# Altium schematic sheet Mcu.SchDoc
size A3; SheetNumber: 2; SheetTotal: 3
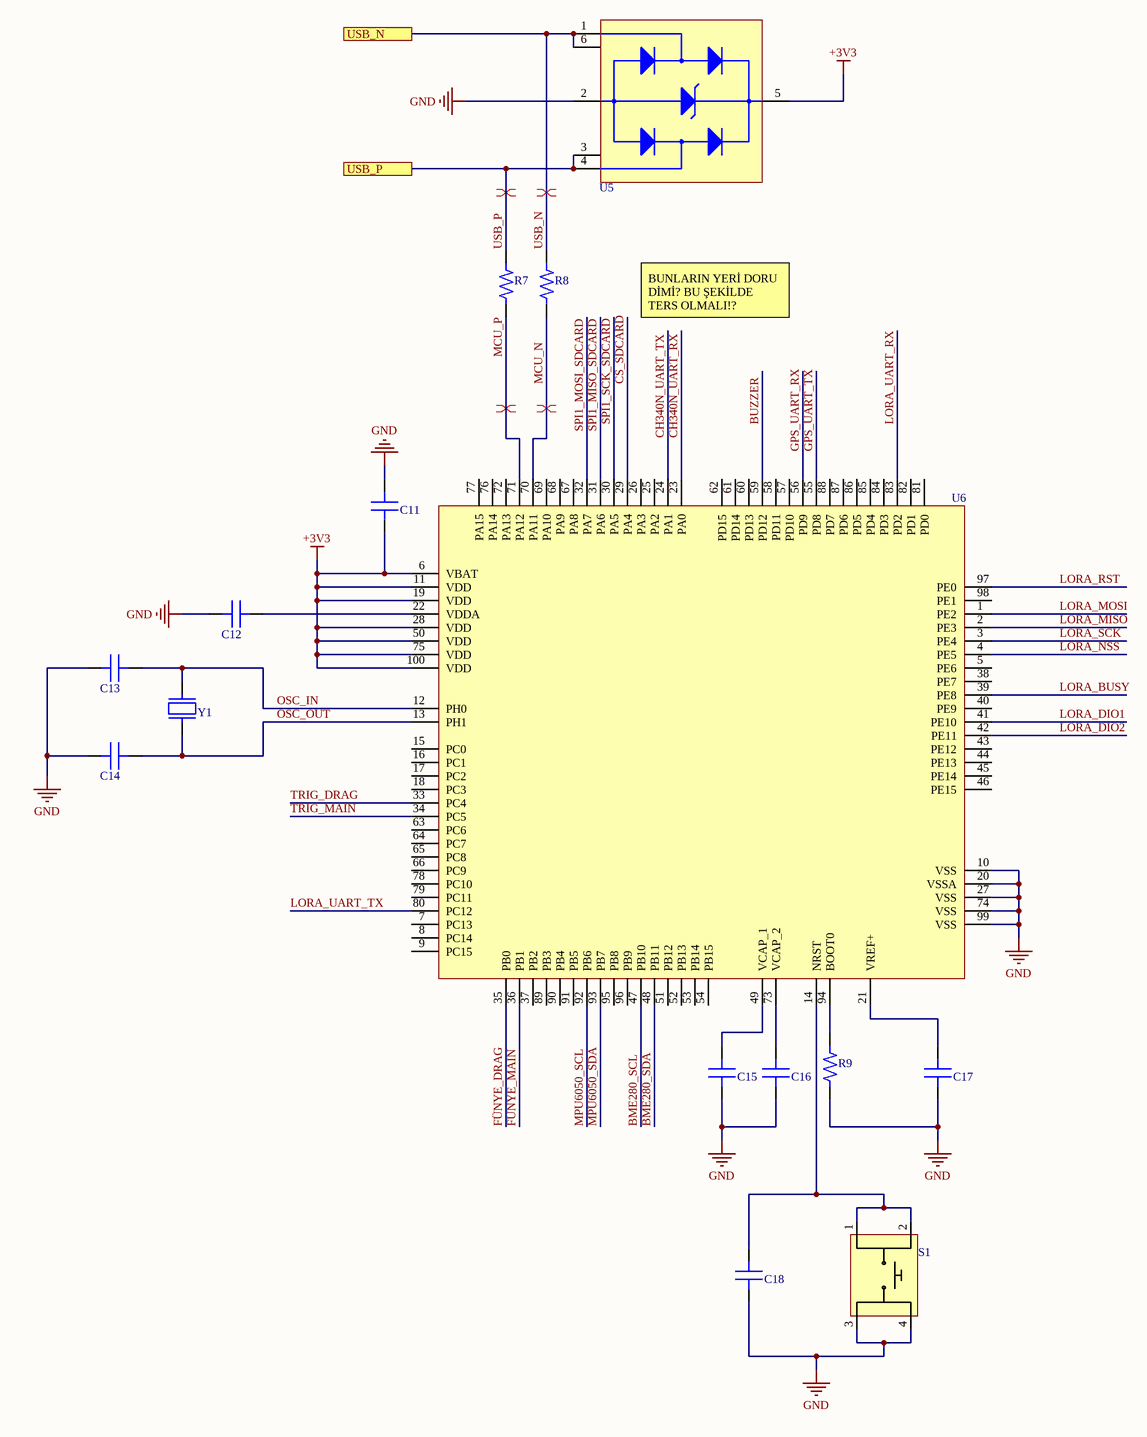
[diagram p0: Mcu.SchDoc]

## Parts
C11  CAP CER 1uF 0805  [CAP_0805]  (value not drawn)
C12  CAP CER 10nF 0805  [CAP_0805]  (value not drawn)
C13  CAP CER 20pF 0805  [CAP_0805]  (value not drawn)
C14  CAP CER 20pF 0805  [CAP_0805]  (value not drawn)
C15  CAP CER 2.2uF 0805  [CAP_0805]  (value not drawn)
C16  CAP CER 2.2uF 0805  [CAP_0805]  (value not drawn)
C17  CAP CER 10nF 0805  [CAP_0805]  (value not drawn)
C18  CAP CER 0.1uF 0805  [CAP_0805]  (value not drawn)
R7  RES 15 OHM 0805  [RES_0805]  (value not drawn)
R8  RES 15 OHM 0805  [RES_0805]  (value not drawn)
R9  RES 10K OHM 0805  [RES_0805]  (value not drawn)
S1  PTS815 SJG 250 SMTR LFS  [BUTTON]  (value not drawn)
U5  USBLC6-2SC6  [SOT-23-6L]  (value not drawn)
U6  STM32F407VGT6  [LQFP-100]  (value not drawn)
Y1  CRYSTAL 32.7680KHZ 12.5PF SMD  [CRYSTAL_ABS05]  (value not drawn)

## Ports
USB_N, USB_P

## Nets
+3V3: C11.1 U5.5(VBUS) U6.6(VBAT) U6.11(VDD) U6.19(VDD) U6.28(VDD) U6.50(VDD) U6.75(VDD) U6.100(VDD)
GND: C11.2 C12.1 C13.1 C14.1 C15.1 C16.1 C17.1 C18.1 R9.1 S1.3 S1.4 U5.2(GND) U6.10(VSS) U6.20(VSSA) U6.27(VSS) U6.74(VSS) U6.99(VSS)
BME280_SCL: U6.47(PB10)
BME280_SDA: U6.48(PB11)
BUZZER: U6.59(PD12)
CH340N_UART_RX: U6.23(PA0)
CH340N_UART_TX: U6.24(PA1)
CS_SDCARD: U6.29(PA4)
FÜNYE_DRAG: U6.35(PB0)
FÜNYE_MAIN: U6.36(PB1)
GPS_UART_RX: U6.56(PD9)
GPS_UART_TX: U6.55(PD8)
LORA_BUSY: U6.39(PE8)
LORA_DIO1: U6.41(PE10)
LORA_DIO2: U6.42(PE11)
LORA_MISO: U6.2(PE3)
LORA_MOSI: U6.1(PE2)
LORA_NSS: U6.4(PE5)
LORA_RST: U6.97(PE0)
LORA_SCK: U6.3(PE4)
LORA_UART_RX: U6.83(PD2)
LORA_UART_TX: U6.80(PC12)
MCU_N: R8.1 U6.70(PA11)
MCU_P: R7.1 U6.71(PA12)
MPU6050_SCL: U6.92(PB6)
MPU6050_SDA: U6.93(PB7)
OSC_IN: C13.2 U6.12(PH0) Y1.2
OSC_OUT: C14.2 U6.13(PH1) Y1.1
SPI1_MISO_SDCARD: U6.31(PA6)
SPI1_MOSI_SDCARD: U6.32(PA7)
SPI1_SCK_SDCARD: U6.30(PA5)
TRIG_DRAG: U6.33(PC4)
TRIG_MAIN: U6.34(PC5)
USB_N: R8.2 U5.1(I/O1_IN) U5.6(I/O1_OUT) ; port USB_N
USB_P: R7.2 U5.3(I/O2_IN) U5.4(I/O2_OUT) ; port USB_P
NetC12_2: C12.2 U6.22(VDDA)
NetC15_2: C15.2 U6.49(VCAP_1)
NetC16_2: C16.2 U6.73(VCAP_2)
NetC17_2: C17.2 U6.21(VREF+)
NetC18_2: C18.2 S1.1 S1.2 U6.14(NRST)
NetR9_2: R9.2 U6.94(BOOT0)

Not connected (* = marked no-connect by the designer): U6 5(PE6) 7(PC13) 8(PC14) 9(PC15) 15(PC0) 16(PC1) 17(PC2) 18(PC3) 25(PA2) 26(PA3) 37(PB2) 38(PE7) 40(PE9) 43(PE12) 44(PE13) 45(PE14) 46(PE15) 51(PB12) 52(PB13) 53(PB14) 54(PB15) 57(PD10) 58(PD11) 60(PD13) 61(PD14) 62(PD15) 63(PC6) 64(PC7) 65(PC8) 66(PC9) 67(PA8) 68(PA9) 69(PA10) 72(PA13) 76(PA14) 77(PA15) 78(PC10) 79(PC11) 81(PD0) 82(PD1) 84(PD3) 85(PD4) 86(PD5) 87(PD6) 88(PD7) 89(PB3) 90(PB4) 91(PB5) 95(PB8) 96(PB9) 98(PE1)

## Layout directives
differential pair: MCU_N, MCU_P, USB_N, USB_P

## Notes on the sheet
- BUNLARIN YERİ DORU DİMİ? BU ŞEKİLDE TERS OLMALI!?
- - The high-speed external (HSE) clock can be supplied with a 4 to 26 MHz crystal/ceramic
  resonator oscillator.
  - For CL1 and CL2, it is recommended to use high-quality external ceramic capacitors in the
  5 pF to 25 pF range. CL1 and CL2 are usually the
  same size. (Ben 20pF seçtim)
- (near C17) BOOT0 ekleme yapılabilir-amerika roket

## Library data of the parts
S1 = BUTTON: Switch Tactile N.O. SPST Button J-Bend 0.05A 12VDC 3.92N SMD T/R; Manufacturer: ITT C&K; Supplier 1: Digi-Key; Manufacturer Part Number: PTS815SJG250SMTRLFS; RoHS: Yes; Category: Tactile Switches; Stock 1: 47215; Pricing 1: 1=0,22000, 10=0,21400, 25=0,20280, 100=0,18360, 250=0,16736, 500=0,15558, 1000=0,13271 (USD); Supplier Part Number 1: CKN12217-1-ND
U5 = USB PROTECTION: TVS DIODE 5.25VWM 17VC SOT23-6; Manufacturer: STMicroelectronics; Direction: Unidirectional,Bidirectional; Capacitance: 3.5pF; Operating Supply Voltage: 1.1V; Number of Channels: 2; Breakdown Voltage: 6V; Clamping Voltage: 17V; Reverse Standoff Voltage: 5.25V; Power Line Protection: Yes; Test Current: 1mA; Max Reverse Leakage Current: 150nA; Peak Pulse Current: 5A; Element Configuration: Dual; Data Rate: 480Mbps; Number of Elements: 1; Working Voltage: 5V; Supplier 1: Digi-Key; Manufacturer Part Number: USBLC6-2SC6; RoHS: Yes; Category: TVS Diodes; Stock 1: 127716; Pricing 1: 1=0,61000, 10=0,52200, 100=0,38970, 500=0,30620, 1000=0,23660 (USD); Mount: Surface Mount; Case/Package: SOT-23; Number of Pins: 6; Contact Plating: Tin,Matte; Min Operating Temperature: -40°C; Max Operating Temperature: 125°C; Packaging: Tape and Reel; Package Quantity: 3000; Termination: SMD/SMT; Number of Bidirectional Channels: 2; Min Breakdown Voltage: 6V; ESD Protection: Yes; Leakage Current: 150nA; Series: USB; Reverse Breakdown Voltage: 6V; Polarity: Unidirectional,Bidirectional; Max Breakdown Voltage: 6V; Clamping Voltage-Max: 17V; Length: 3.05mm; Width: 1.75mm; Height: 1.3mm; Depth: 1.75mm; Radiation Hardening: No; Reach SVHC Compliant: Yes; Lead Free: Lead Free; RoHS Compliant: Yes; ComponentLink1URL: https://datasheet.ciiva.com/1268/1690354-1268384.pdf?src-supplier=Element14; ComponentLink1Description: https://datasheet.ciiva.com/1268/1690354-1268384.pdf?src-supplier=Element14; ComponentLink2URL: https://datasheet.ciiva.com/4508/cd00050750-113117-4508433.pdf?src-supplier=Mouser; ComponentLink2Description: https://datasheet.ciiva.com/4508/cd00050750-113117-4508433.pdf?src-supplier=Mouser; ComponentLink3URL: https://datasheet.ciiva.com/15143/getdatasheetpartid-148465-15143789.pdf?src-supplier=Verical; ComponentLink3Description: https://datasheet.ciiva.com/15143/getdatasheetpartid-148465-15143789.pdf?src-supplier=Verical; ComponentLink4URL: https://datasheet.ciiva.com/16200/cd00050750-16200026.pdf?src-supplier=Future+Electronics; ComponentLink4Description: https://datasheet.ciiva.com/16200/cd00050750-16200026.pdf?src-supplier=Future+Electronics; ComponentLink5URL: https://datasheet.ciiva.com/41444/001184109-da-01-en-ic-esd-protecti-usblc6-2sc6-sot-23-6-stm-41444156.pdf?src-supplier=Conrad; ComponentLink5Description: https://datasheet.ciiva.com/41444/001184109-da-01-en-ic-esd-protecti-usblc6-2sc6-sot-23-6-stm-41444156.pdf?src-supplier=Conrad; Supplier Part Number 1: 497-5235-1-ND
U6 = STM32F407VGT6: IC MCU 32BIT 1MB FLASH 100LQFP; Manufacturer: STMicroelectronics; Core Architecture: ARM; Interface: I2C,SPI,USB,CAN,Ethernet,IrDA,UART,USART,LIN,EBI/EMI,I2S; Data Bus Width: 32b; Max Supply Voltage: 3.6V; Min Supply Voltage: 1.8V; Number of I/Os: 82; Frequency: 168MHz; RAM Size: 196KB; Oscillator Type: Internal; Memory Size: 1024KB; Peripherals: Brown-out Detect/Reset,POR,PWM,WDT,DMA,LCD,I2C; Number of Timers/Counters: 14; Watchdog Timer: Yes; Number of ADC Channels: 16; Number of PWM Channels: 2; Number of SPI Channels: 3; Number of Ethernet Channels: 1; Supplier 1: Digi-Key; Manufacturer Part Number: STM32F407VGT6; RoHS: Yes; Category: Microcontrollers; Pricing 1: 1=16,52000, 10=15,18400, 25=14,55440, 90=12,82367, 270=12,19433, 450=11,40760 (USD); Case/Package: LQFP; Number of Pins: 100; Min Operating Temperature: -40°C; Max Operating Temperature: 85°C; Series: STM32 F4; Package Quantity: 90; Packaging: Tray; Max Frequency: 168MHz; Memory Type: FLASH; Number of Programmable I/O: 82; Number of I2C Channels: 3; Number of UART Channels: 2; Address Bus Width: 32b; Length: 14.2mm; Width: 14.2mm; Height: 1.45mm; Radiation Hardening: No; Reach SVHC Compliant: Yes; Lead Free: Lead Free; RoHS Compliant: Yes; ComponentLink1URL: https://datasheet.ciiva.com/14132/stm32f407vgt6-tds-eng-14132567.pdf?src-supplier=Distrelec; ComponentLink1Description: https://datasheet.ciiva.com/14132/stm32f407vgt6-tds-eng-14132567.pdf?src-supplier=Distrelec; ComponentLink2URL: https://datasheet.ciiva.com/4842/dm00037051-492832-4842280.pdf?src-supplier=Mouser; ComponentLink2Description: https://datasheet.ciiva.com/4842/dm00037051-492832-4842280.pdf?src-supplier=Mouser; ComponentLink3URL: https://datasheet.ciiva.com/48687/001075599-da-01-en-mcu-32bt-1mb-stm32f407vgt6-lqfp-100-stm-48687547.pdf?src-supplier=Conrad; ComponentLink3Description: https://datasheet.ciiva.com/48687/001075599-da-01-en-mcu-32bt-1mb-stm32f407vgt6-lqfp-100-stm-48687547.pdf?src-supplier=Conrad; Supplier Part Number 1: 497-11605-ND
Y1 = CRYSTAL: Crystal 0.032768MHz ±20ppm (Tol) 12.5pF Flexural 90000Ohm 2-Pin CSMD T/R; Manufacturer: Abracon; Manufacturer Part Number: ABS05-32.768KHZ-T; Frequency: 32.768kHz; ESR (Equivalent Series Resistance): 90kR; Operating Frequency: 32.768 kHz; Supplier 1: Digi-Key; RoHS: Yes; Category: Crystals; Stock 1: 376220; Pricing 1: 1=0,66000, 10=0,58100, 50=0,54340, 100=0,48020, 500=0,45494, 1000=0,37911 (USD); Mount: Surface Mount; Case/Package: CSMD; Number of Pins: 2; Min Operating Temperature: -40°C; Max Operating Temperature: 85°C; Packaging: Tape and Reel; Frequency Tolerance: 20ppm; Load Capacitance: 12.5pF; Package Quantity: 3000; Tolerance: 20ppm; Termination: SMD/SMT; Series Resistance: 90kR; Series: ABS05; Length: 1.6mm; Width: 1mm; Height: 0.5mm; Depth: 1mm; Radiation Hardening: No; Reach SVHC Compliant: Yes; Lead Free: Lead Free; RoHS Compliant: Yes; ComponentLink1URL: https://datasheet.ciiva.com/23810/abs05-23810480.pdf?src-supplier=Newark; ComponentLink1Description: https://datasheet.ciiva.com/23810/abs05-23810480.pdf?src-supplier=Newark; ComponentLink2URL: https://datasheet.ciiva.com/6728/abs05-6728949.pdf?src-supplier=Digi-Key; ComponentLink2Description: https://datasheet.ciiva.com/6728/abs05-6728949.pdf?src-supplier=Digi-Key; ComponentLink3URL: https://datasheet.ciiva.com/6728/abs05-6728950.pdf?src-supplier=Digi-Key; ComponentLink3Description: https://datasheet.ciiva.com/6728/abs05-6728950.pdf?src-supplier=Digi-Key; ComponentLink4URL: https://datasheet.ciiva.com/16411/abs05-16411149.pdf?src-supplier=Future+Electronics; ComponentLink4Description: https://datasheet.ciiva.com/16411/abs05-16411149.pdf?src-supplier=Future+Electronics; Supplier Part Number 1: 535-11899-1-ND